# Altium schematic sheet ST_Link.SchDoc
size C
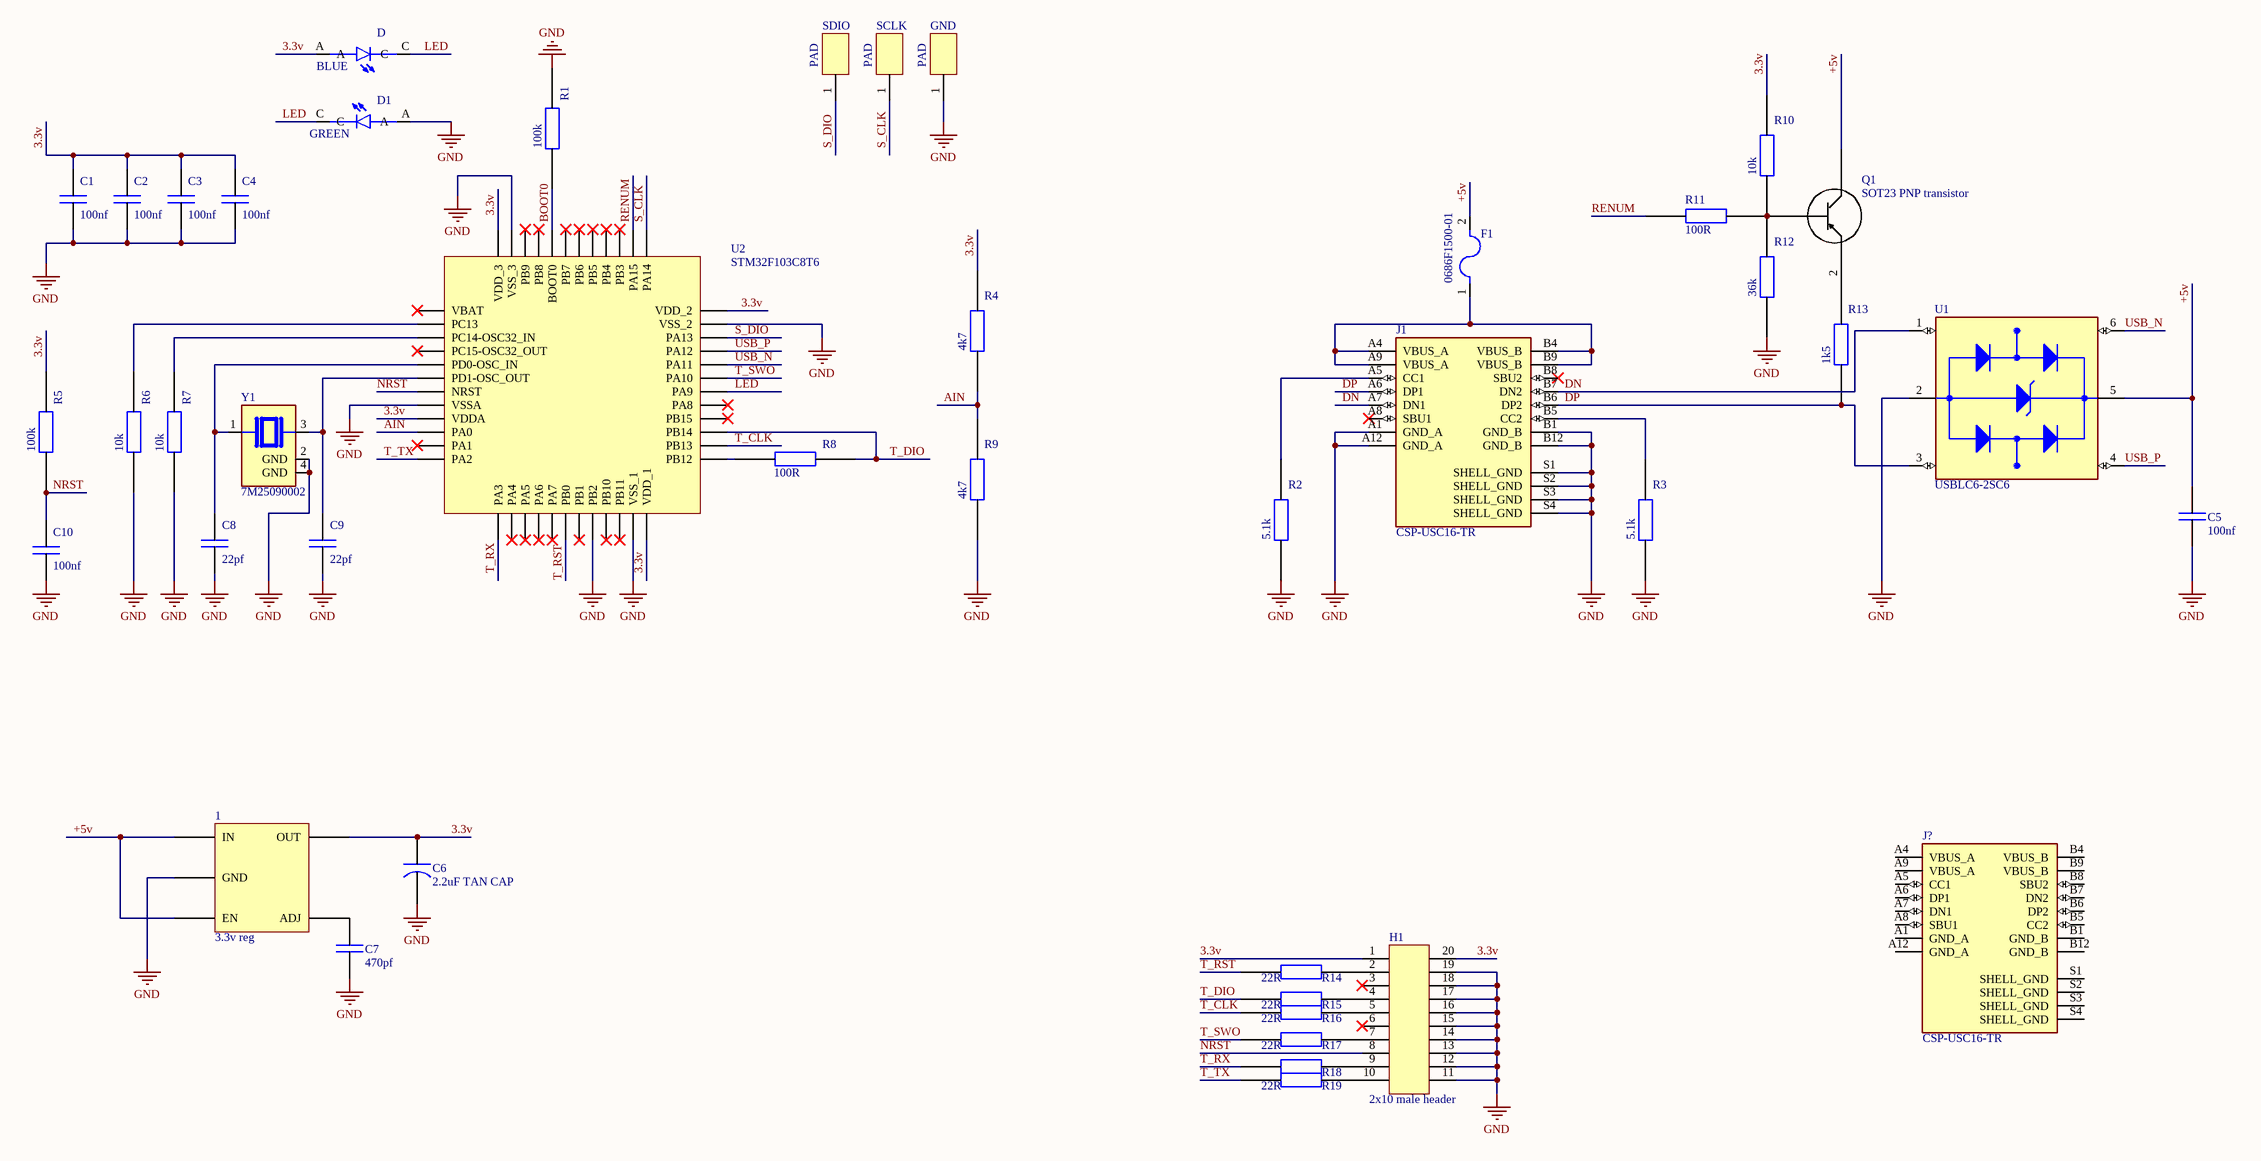
[diagram p0: ST_Link.SchDoc]

## Parts
1  3.3v reg  [3.3v reg]
C1  100nf  [0603 CAP]
C2  100nf  [0603 CAP]
C3  100nf  [0603 CAP]
C4  100nf  [0603 CAP]
C5  100nf  [0603 CAP]
C6  2.2uF TAN CAP  [2.2uF TAN CAP]
C7  470pf  [0603 CAP]
C8  22pf  [0603 CAP]
C9  22pf  [0603 CAP]
C10  100nf  [0603 CAP]
D  BLUE  [LEDSC160X80X70L45N]
D1  GREEN  [LEDSC160X80X70L45N]
F1  0686F1500-01  [FUSC1608X60N]
GND  PAD  [PAD]
H1  2x10 male header  [2x10 MALE HEADER - duplicate]
J1  CSP-USC16-TR  [VALCON_CSP-USC16-TR]
J?  CSP-USC16-TR  [VALCON_CSP-USC16-TR]
Q1  SOT23 PNP transistor  [PCBComponent_1]
R1  100k  [0603 RES]
R2  5.1k  [0603 RES]
R3  5.1k  [0603 RES]
R4  4k7  [0603 RES]
R5  100k  [0603 RES]
R6  10k  [0603 RES]
R7  10k  [0603 RES]
R8  100R  [0603 RES]
R9  4k7  [0603 RES]
R10  10k  [0603 RES]
R11  100R  [0603 RES]
R12  36k  [0603 RES]
R13  1k5  [0603 RES]
R14  22R  [0603 RES]
R15  22R  [0603 RES]
R16  22R  [0603 RES]
R17  22R  [0603 RES]
R18  (no value)  [0603 RES]
R19  22R  [0603 RES]
SCLK  PAD  [PAD]
SDIO  PAD  [PAD]
U1  USBLC6-2SC6  [SOT95P280X145-6N]
U2  STM32F103C8T6  [STM32F103C8T6]
Y1  7M25090002  [XTAL_7M25090002]

## Nets
GND: 1.2(GND) C1.1 C2.1 C3.1 C4.1 C5.1 C6.2 C7.1 C8.1 C9.1 C10.1 D1.A GND.1 H1.11 H1.12 H1.13 H1.14 H1.15 H1.16 H1.17 H1.18 H1.19 J1.A1(GND_A) J1.A12(GND_A) J1.B1(GND_B) J1.B12(GND_B) J1.S1(SHELL_GND) J1.S2(SHELL_GND) J1.S3(SHELL_GND) J1.S4(SHELL_GND) R1.2 R2.1 R3.1 R6.1 R7.1 R9.1 R12.1 U1.2(GND) U2.8(VSSA) U2.20(PB2) U2.23(VSS_1) U2.35(VSS_2) U2.47(VSS_3) Y1.2(GND) Y1.4(GND)
3.3v: 1.5(OUT) C1.2 C2.2 C3.2 C4.2 C6.1 D.A H1.1 H1.20 R4.2 R5.2 R10.2 U2.9(VDDA) U2.24(VDD_1) U2.36(VDD_2) U2.48(VDD_3)
+5v: 1.1(IN) 1.3(EN) C5.2 F1.2 Q1.3(E) U1.5(VBUS)
AIN: R4.1 R9.2 U2.10(PA0)
BOOT0: R1.1 U2.44(BOOT0)
DN: J1.A7(DN1) J1.B7(DN2) U1.1(I/O1_IN)
DP: J1.A6(DP1) J1.B6(DP2) R13.1 U1.3(I/O2_IN)
LED: D.C D1.C U2.30(PA9)
NRST: C10.2 H1.8 R5.1 U2.7(NRST)
RENUM: R11.1 U2.38(PA15)
S_CLK: SCLK.1 U2.37(PA14)
S_DIO: SDIO.1 U2.34(PA13)
T_CLK: R16.1 U2.26(PB13)
T_DIO: R8.2 R15.1 U2.27(PB14)
T_RST: R14.1 U2.18(PB0)
T_RX: R18.1 U2.13(PA3)
T_SWO: R17.1 U2.31(PA10)
T_TX: R19.1 U2.12(PA2)
USB_N: U1.6(I/O1_OUT) U2.32(PA11)
USB_P: U1.4(I/O2_OUT) U2.33(PA12)
Net1_4: 1.4(ADJ) C7.2
NetC8_2: C8.2 U2.5(PD0-OSC_IN) Y1.1
NetC9_2: C9.2 U2.6(PD1-OSC_OUT) Y1.3
NetF1_1: F1.1 J1.A4(VBUS_A) J1.A9(VBUS_A) J1.B4(VBUS_B) J1.B9(VBUS_B)
NetH1_2: H1.2 R14.2
NetH1_4: H1.4 R15.2
NetH1_5: H1.5 R16.2
NetH1_7: H1.7 R17.2
NetH1_9: H1.9 R18.2
NetH1_10: H1.10 R19.2
NetJ1_A5: J1.A5(CC1) R2.2
NetJ1_B5: J1.B5(CC2) R3.2
NetQ1_1: Q1.1(B) R10.1 R11.2 R12.2
NetQ1_2: Q1.2(C) R13.2
NetR6_2: R6.2 U2.2(PC13)
NetR7_2: R7.2 U2.3(PC14-OSC32_IN)
NetR8_1: R8.1 U2.25(PB12)

Not connected (* = marked no-connect by the designer): H1 3* 6*; J1 A8(SBU1)* B8(SBU2)*; J? A1(GND_A) A4(VBUS_A) A5(CC1) A6(DP1) A7(DN1) A8(SBU1) A9(VBUS_A) A12(GND_A) B1(GND_B) B4(VBUS_B) B5(CC2) B6(DP2) B7(DN2) B8(SBU2) B9(VBUS_B) B12(GND_B) S1(SHELL_GND) S2(SHELL_GND) S3(SHELL_GND) S4(SHELL_GND); U2 1(VBAT)* 4(PC15-OSC32_OUT)* 11(PA1)* 14(PA4)* 15(PA5)* 16(PA6)* 17(PA7)* 19(PB1)* 21(PB10)* 22(PB11)* 28(PB15)* 29(PA8)* 39(PB3)* 40(PB4)* 41(PB5)* 42(PB6)* 43(PB7)* 45(PB8)* 46(PB9)*

## Library data of the parts
C1-C5 C7-C10 = 0603 CAP
D D1 = 597-3326-607F: Green 525nm LED Indication - Discrete 3.4V 0603 _1608 Metric_; MF: Dialight; Package: 0603 Dialight; Digi-Key_Part_Number: 5973326607F-ND; SnapEDA_Link: https://www.snapeda.com/parts/597-3326-607F/Dialight/view-part/473703/?ref=snap; Digi-Key_Purchase_URL: https://www.digikey.com/product-detail/en/dialight/5973326607F/5973326607F-ND/2432552?utm_source=snapeda&utm_medium=aggregator&utm_campaign=symbol; Value: *; MP: 597-3326-607F
F1 = 0686F1500-01: 0603 SMT Fuse | Fast Acting | 1.5A; MF: Bel Fuse; MP: 0686F1500-01; Value: *; Package: 0603 Bel Fuse Inc.; Price: None; Availability: Warning; SnapEDA_Link: https://www.snapeda.com/parts/0686F1500-01/Bel%20Fuse/view-part/4616395/?ref=snap; Purchase-URL: https://pricing.snapeda.com/search/part/0686F1500-01/?ref=eda
H1 = 2x10 male header: 2.54mm pitch 2x10 male header
J1 J? = CSP-USC16-TR: CSP-USC16-TR Valcon USB Type C Surface Mount PCB Socket; SnapEDA_Link: https://www.snapeda.com/parts/CSP-USC16-TR/Valcon/view-part/?ref=snap; MF: Valcon; MP: CSP-USC16-TR; Availability: In Stock; Price: None; Value: *; Check_prices: https://www.snapeda.com/parts/CSP-USC16-TR/Valcon/view-part/?ref=eda; Package: None; Purchase-URL: https://pricing.snapeda.com/search/part/CSP-USC16-TR/?ref=eda
Q1 = BC857
R1-R19 = 0603 RES
U1 = USBLC6-2SC6: 17V Clamp 5A (8/20Âµs) Ipp Tvs Diode Surface Mount SOT-23-6; MF: STMicroelectronics; Value: *; SnapEDA_Link: https://www.snapeda.com/parts/USBLC6-2SC6/STMicroelectronics/view-part/?ref=snap; Check_prices: https://www.snapeda.com/parts/USBLC6-2SC6/STMicroelectronics/view-part/?ref=eda; Purchase-URL: https://pricing.snapeda.com/search/part/USBLC6-2SC6/?ref=eda; Price: None; Availability: In Stock; Package: SOT-23-6 STMicroelectronics; MP: USBLC6-2SC6
Y1 = 7M25090002: 25 MHz Â±10ppm Crystal 18pF 4-SMD, No Lead; MF: TXC; Availability: In Stock; Check_prices: https://www.snapeda.com/parts/7M25090002/TXC/view-part/?ref=eda; Price: None; SnapEDA_Link: https://www.snapeda.com/parts/7M25090002/TXC/view-part/?ref=snap; MP: 7M25090002; Value: *; Purchase-URL: https://pricing.snapeda.com/search/part/7M25090002/?ref=eda; Package: SMD-4 TXC